# Altium schematic sheet Accelerometer_3Axis.SchDoc
size A4
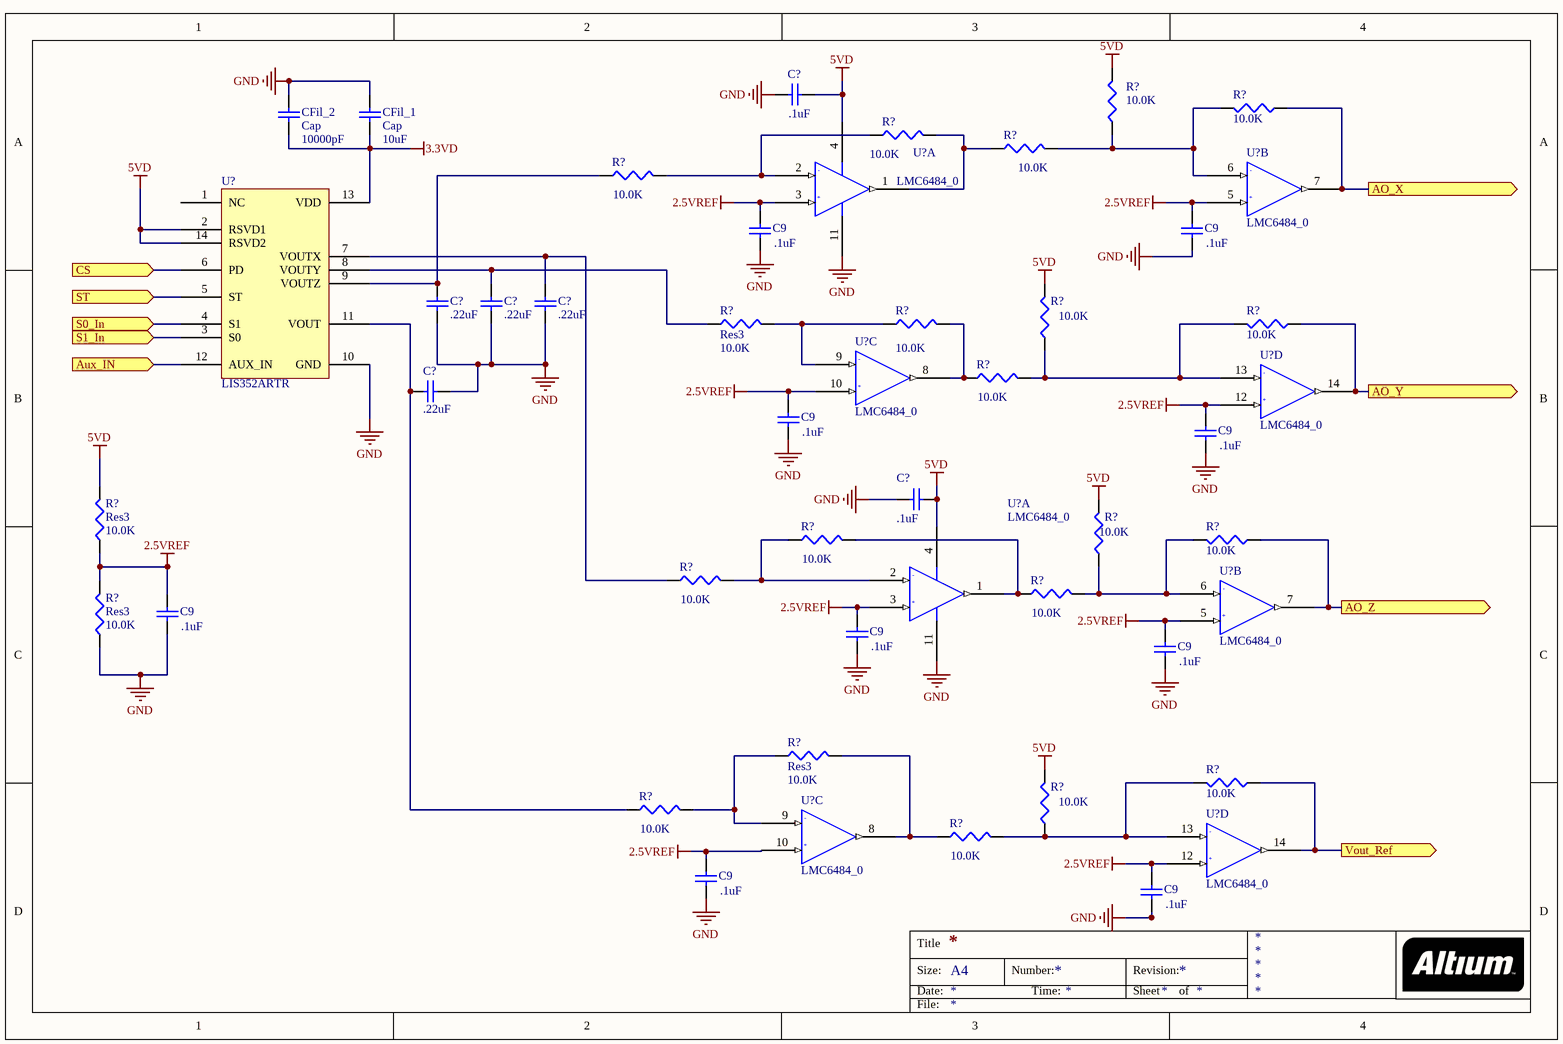
[diagram p0: Accelerometer_3Axis.SchDoc]

## Parts
(Parts that share a designator on the sheet are numbered #1, #2 ... from top to bottom, then left to right.)
C9#1  value .1uF  [CAPC2012X09M]  (hidden comment: p)
C9#2  value .1uF  [CAPC2012X09M]  (hidden comment: p)
C9#3  value .1uF  [CAPC2012X09M]  (hidden comment: p)
C9#4  value .1uF  [CAPC2012X09M]  (hidden comment: p)
C9#5  value .1uF  [CAPC2012X09M]  (hidden comment: p)
C9#6  value .1uF  [CAPC2012X09M]  (hidden comment: p)
C9#7  value .1uF  [CAPC2012X09M]  (hidden comment: p)
C9#8  value .1uF  [CAPC2012X09M]  (hidden comment: p)
C9#9  value .1uF  [CAPC2012X09M]  (hidden comment: p)
C?#1  value .1uF  [CAPC2012X09M]  (hidden comment: ap)
C?#2  value .22uF  [CAPC2012X09M]  (hidden comment: Cap)
C?#3  value .22uF  [CAPC2012X09M]  (hidden comment: Cap)
C?#4  value .22uF  [CAPC2012X09M]  (hidden comment: Cap)
C?#5  value .22uF  [CAPC2012X09M]  (hidden comment: Cap)
C?#6  value .1uF  [CAPC2012X09M]  (hidden comment: Cap)
CFil_1  Cap  value 10uF  [CAPC2012X09M]
CFil_2  Cap  value 10000pF  [CAPC2012X09M]
R?#1  value 10.0K  [RESC2112X05M]  (hidden comment: Res3)
R?#2  value 10.0K  [RESC2112X05M]  (hidden comment: Res3)
R?#3  value 10.0K  [RESC2112X05M]  (hidden comment: Res3)
R?#4  value 10.0K  [RESC2112X05M]  (hidden comment: Res3)
R?#5  value 10.0K  [RESC2112X05M]  (hidden comment: Res3)
R?#6  Res3  value 10.0K  [RESC2112X05M]
R?#7  value 10.0K  [RESC2112X05M]  (hidden comment: Res3)
R?#8  value 10.0K  [RESC2112X05M]  (hidden comment: Res3)
R?#9  value 10.0K  [RESC2112X05M]  (hidden comment: Res3)
R?#10  value 10.0K  [RESC2112X05M]  (hidden comment: Res3)
R?#11  value 10.0K  [RESC2112X05M]  (hidden comment: Res3)
R?#12  Res3  value 10.0K  [RESC2112X05M]
R?#13  value 10.0K  [RESC2112X05M]  (hidden comment: Res3)
R?#14  value 10.0K  [RESC2112X05M]  (hidden comment: Res3)
R?#15  value 10.0K  [RESC2112X05M]  (hidden comment: Res3)
R?#16  value 10.0K  [RESC2112X05M]  (hidden comment: Res3)
R?#17  Res3  value 10.0K  [RESC2112X05M]
R?#18  Res3  value 10.0K  [RESC2112X05M]
R?#19  value 10.0K  [RESC2112X05M]  (hidden comment: Res3)
R?#20  value 10.0K  [RESC2112X05M]  (hidden comment: Res3)
R?#21  value 10.0K  [RESC2112X05M]  (hidden comment: Res3)
R?#22  value 10.0K  [RESC2112X05M]  (hidden comment: Res3)
U?#1  LMC6484_0  [SOIC127P600X175-14M-NS]  (part A of 4)
U?#2  LMC6484_0  [SOIC127P600X175-14M-NS]  (part B of 4)
U?#3  LIS352ARTR  [LGA-14-3X5MM]
U?#4  LMC6484_0  [SOIC127P600X175-14M-NS]  (part C of 4)
U?#5  LMC6484_0  [SOIC127P600X175-14M-NS]  (part D of 4)
U?#6  LMC6484_0  [SOIC127P600X175-14M-NS]  (part A of 4)
U?#7  LMC6484_0  [SOIC127P600X175-14M-NS]  (part B of 4)
U?#8  LMC6484_0  [SOIC127P600X175-14M-NS]  (part C of 4)
U?#9  LMC6484_0  [SOIC127P600X175-14M-NS]  (part D of 4)

## Ports
AO_X (out), AO_Y (out), AO_Z (out), Aux_IN (in), CS (in), S0_In (in), S1_In (in), ST (in), Vout_Ref (out)

## Nets
2.5VREF: C9#1.2 C9#2.2 C9#3.2 C9#4.2 C9#5.2 C9#6.2 C9#7.2 C9#8.2 C9#9.2 R?#12.1 R?#17.2 U?#1.3(NINVIN_1) U?#2.5(NINVIN2) U?#4.10(NINVIN3) U?#5.12(NINVIN4) U?#6.3(NINVIN_1) U?#7.5(NINVIN2) U?#8.10(NINVIN3) U?#9.12(NINVIN4)
3.3VD: CFil_1.1 CFil_2.1 U?#3.13(VDD)
5VD: C?#1.2 C?#6.2 R?#2.2 R?#8.2 R?#12.2 R?#13.2 R?#22.2 U?#1.4(VCC) U?#3.2(RSVD1) U?#3.14(RSVD2) U?#6.4(VCC)
GND: C9#1.1 C9#2.1 C9#3.1 C9#4.1 C9#5.1 C9#6.1 C9#7.1 C9#8.1 C9#9.1 C?#1.1 C?#2.1 C?#3.1 C?#4.1 C?#5.1 C?#6.1 CFil_1.2 CFil_2.2 R?#17.1 U?#1.11(-VCC) U?#3.10(GND) U?#6.11(-VCC)
AO_X: R?#3.1 U?#2.7(OUT2) ; port AO_X
AO_Y: R?#9.1 U?#5.14(OUT4) ; port AO_Y
AO_Z: R?#14.1 U?#7.7(OUT2) ; port AO_Z
Aux_IN: U?#3.12(AUX_IN) ; port Aux_IN
CS: U?#3.6(PD) ; port CS
S0_In: U?#3.4(S1) ; port S0_In
S1_In: U?#3.3(S0) ; port S1_In
ST: U?#3.5(ST) ; port ST
Vout_Ref: R?#20.1 U?#9.14(OUT4) ; port Vout_Ref
NetC?#2_2: C?#2.2 R?#5.1 U?#3.9(VOUTZ)
NetC?#3_2: C?#3.2 R?#6.1 U?#3.8(VOUTY)
NetC?#4_2: C?#4.2 R?#15.1 U?#3.7(VOUTX)
NetC?#5_2: C?#5.2 R?#19.1 U?#3.11(VOUT)
NetR?#1_1: R?#1.1 R?#5.2 U?#1.2(INVIN_1)
NetR?#1_2: R?#1.2 R?#4.1 U?#1.1(OUT1)
NetR?#2_1: R?#2.1 R?#3.2 R?#4.2 U?#2.6(INVIN2)
NetR?#6_2: R?#6.2 R?#7.1 U?#4.9(INVIN3)
NetR?#7_2: R?#7.2 R?#10.1 U?#4.8(OUT3)
NetR?#8_1: R?#8.1 R?#9.2 R?#10.2 U?#5.13(INVIN4)
NetR?#11_1: R?#11.1 R?#15.2 U?#6.2(INVIN_1)
NetR?#11_2: R?#11.2 R?#16.1 U?#6.1(OUT1)
NetR?#13_1: R?#13.1 R?#14.2 R?#16.2 U?#7.6(INVIN2)
NetR?#18_1: R?#18.1 R?#19.2 U?#8.9(INVIN3)
NetR?#18_2: R?#18.2 R?#21.1 U?#8.8(OUT3)
NetR?#20_2: R?#20.2 R?#21.2 R?#22.1 U?#9.13(INVIN4)

Not connected (* = marked no-connect by the designer): U?#3 1(NC)

## Notes on the sheet
- Title
- Size:
- Date:
- A4
- Number:
- Time:
- Revision:
- Sheet
- of
- File:
- (in symbol LMC6484_0, part A) -; +
- (in symbol LMC6484_0, part B) -; +
- (in symbol LMC6484_0, part C) -; +
- (in symbol LMC6484_0, part D) -; +

## Library data of the parts
C9#1-C9#9 = CAP-X7R-.1uF-16V-±10%: CAP CER .1uF 16v X7R 0805; MPN: C0805C104K4RACTU; PN: 399-1167-1-ND; Name: CAP-X7R-.1uF-16V-±10%; URL: http://www.digikey.ca/product-detail/en/C0805C104K4RACTU/399-1167-1-ND
C?#1 C?#6 = CAP-X7R-.1uF-50V-±20%: CAP CER .1uF 50v X7R 0805; MPN: C0805C104M5RACTU; PN: 399-1169-1-ND; Name: CAP-X7R-.1uF-50V-±20%; URL: http://www.digikey.ca/product-detail/en/C0805C104M5RACTU/399-1169-1-ND
C?#2-C?#5 = CAP-X7R-.22uF-50V-±10%: CAP CER .22uF 50v X7R 0805; MPN: C0805C224K5RACTU; PN: 399-3491-1-ND; Name: CAP-X7R-.22uF-50V-±10%; URL: http://www.digikey.ca/product-detail/en/C0805C224K5RACTU/399-3491-1-ND
CFil_1 = CAP-X5R-10uF-6.3V-±10%: CAP CER 10uF 6.3v X5R 0805; MPN: C0805C106K9PACTU; PN: 399-3138-1-ND; Name: CAP-X5R-10uF-6.3V-±10%; URL: http://www.digikey.ca/product-detail/en/C0805C106K9PACTU/399-3138-1-ND
CFil_2 = CAP-Z5U-10000pF-50V-±20%: CAP CER 10000pF 50v Z5U 0805; MPN: C0805C103M5UACTU; PN: 399-1174-1-ND; Name: CAP-Z5U-10000pF-50V-±20%; URL: http://www.digikey.ca/product-detail/en/C0805C103M5UACTU/399-1174-1-ND
R?#1-R?#22 = Resistor_10.0K: RES SMD 10.0K OHM 1% 1/8W 0805; MPN: CRCW080510K0FKEA; PN: 541-1000KCCT-ND; Name: Resistor_10.0K; URL: http://www.digikey.ca/product-detail/en/CRCW080510K0FKEA/541-1000KCCT-ND
U?#1 U?#2 U?#4-U?#9 = LMC6484_0: IC OPAMP GP 1.5MHZ RRO 14SOIC; MPN: LMC6484IMX/NOPB; PN: LMC6484IMX/NOPBCT-ND; URL: http://www.digikey.ca/product-detail/en/LMC6484IMX%2FNOPB/LMC6484IMX%2FNOPBCT-ND
U?#3 = LIS352AR: IC ACCELEROMETER 3AXIS LP 14LGA; PN: 497-11075-1-ND; MPN: LIS352ARTR; URL: http://www.digikey.ca/product-detail/en/LIS352ARTR/497-11075-1-ND